# EAGLE design ProDuino-PTH (EAGLE 6.5.0)
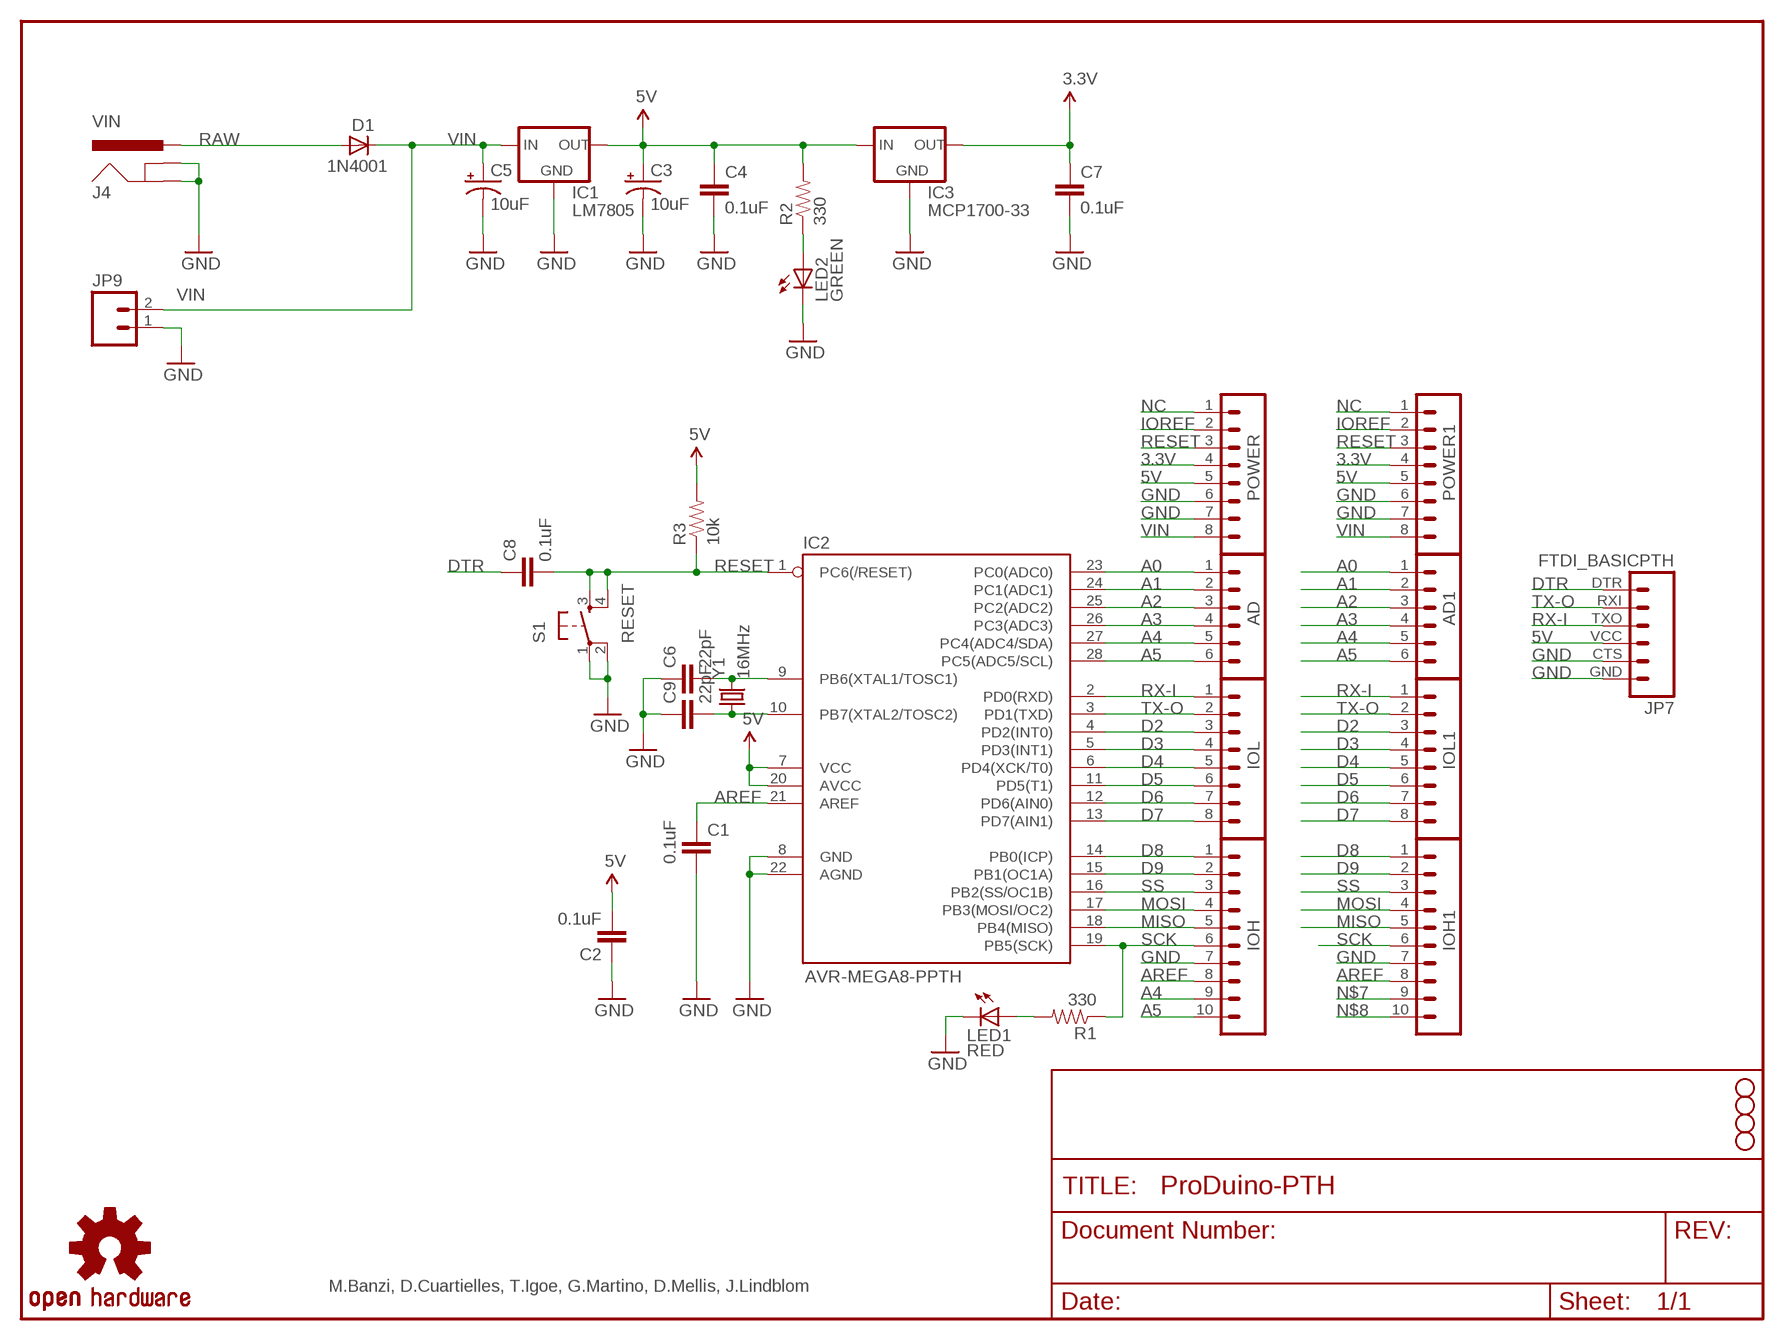
[diagram p0: schematic, sheet 1]

## Parts
AD  M06SIP  [1X06]
AD1  M06SIP  [1X06]
C1  0.1uF  CAPPTH2  [CAP-PTH-SMALL2]
C2  0.1uF  CAPPTH2  [CAP-PTH-SMALL2]
C3  10uF  CAP_POLPTH2  [CPOL-RADIAL-10UF-25V]
C4  0.1uF  CAPPTH2  [CAP-PTH-SMALL2]
C5  10uF  CAP_POLPTH2  [CPOL-RADIAL-10UF-25V]
C6  22pF  CAPPTH2  [CAP-PTH-SMALL2]
C7  0.1uF  CAPPTH2  [CAP-PTH-SMALL2]
C8  0.1uF  CAPPTH2  [CAP-PTH-SMALL2]
C9  22pF  CAPPTH2  [CAP-PTH-SMALL2]
D1  1N4001  DIODEPTH  [DIODE-1N4001]
IC1  LM7805  V_REG_78XX-TO-220  [TO-220-ALT]
IC2  AVR-MEGA8-PPTH  [DIL28-3]
IC3  MCP1700-33  V_REG_78XXTO-92  [TO-92]
IOH  M10"  [1X10]
IOH1  M10"  [1X10]
IOL  M081X08  [1X08]
IOL1  M081X08  [1X08]
J4  VIN  POWER_JACKPTH_LOCK  [POWER_JACK_PTH_LOCK]
JP3  STAND-OFF  [STAND-OFF]
JP4  STAND-OFF  [STAND-OFF]
JP5  STAND-OFF  [STAND-OFF]
JP6  STAND-OFF  [STAND-OFF]
JP7  FTDI_BASICPTH  [FTDI_BASIC]
JP9  M02POLAR  [MOLEX-1X2]
LED1  RED  LED5MM  [LED5MM]
LED2  GREEN  LED5MM  [LED5MM]
POWER  M081X08  [1X08]
POWER1  M081X08  [1X08]
R1  330  RESISTORAXIAL-0.3  [AXIAL-0.3]
R2  330  RESISTORAXIAL-0.3  [AXIAL-0.3]
R3  10k  RESISTORAXIAL-0.3  [AXIAL-0.3]
S1  RESET  TAC_SWITCHPTH  [TACTILE-PTH]
U$7  OSHW-LOGOM  [OSHW-LOGO-M]
Y1  16MHz  CRYSTALHC49US  [HC49US]

## Nets
3.3V: C7.1 IC3.3(OUT) POWER1.4 POWER.4
5V: C2.2 C3.1(+) C4.1 IC1.OUT IC2.7(VCC) IC2.20(AVCC) IC3.2(IN) JP7.VCC POWER1.5 POWER.5 R2.P$2 R3.P$2
A0: AD1.1 AD.1 IC2.23(PC0(ADC0))
A1: AD1.2 AD.2 IC2.24(PC1(ADC1))
A2: AD1.3 AD.3 IC2.25(PC2(ADC2))
A3: AD1.4 AD.4 IC2.26(PC3(ADC3))
A4: AD1.5 AD.5 IC2.27(PC4(ADC4/SDA)) IOH.9
A5: AD1.6 AD.6 IC2.28(PC5(ADC5/SCL)) IOH.10
AREF: C1.1 IC2.21(AREF) IOH1.8 IOH.8
D2: IC2.4(PD2(INT0)) IOL1.3 IOL.3
D3: IC2.5(PD3(INT1)) IOL1.4 IOL.4
D4: IC2.6(PD4(XCK/T0)) IOL1.5 IOL.5
D5: IC2.11(PD5(T1)) IOL1.6 IOL.6
D6: IC2.12(PD6(AIN0)) IOL1.7 IOL.7
D7: IC2.13(PD7(AIN1)) IOL1.8 IOL.8
D8: IC2.14(PB0(ICP)) IOH1.1 IOH.1
D9: IC2.15(PB1(OC1A)) IOH1.2 IOH.2
DTR: C8.1 JP7.DTR
GND: C1.2 C2.1 C3.2(-) C4.2 C5.2(-) C6.1 C7.2 C9.1 IC1.GND IC2.8(GND) IC2.22(AGND) IC3.1(GND) IOH1.7 IOH.7 J4.GND J4.GNDBREAK JP7.CTS JP7.GND JP9.1 LED1.K(C) LED2.K(C) POWER1.6 POWER1.7 POWER.6 POWER.7 S1.1 S1.2
IOREF: POWER1.2 POWER.2
MISO: IC2.18(PB4(MISO)) IOH1.5 IOH.5
MOSI: IC2.17(PB3(MOSI/OC2)) IOH1.4 IOH.4
N$1: LED1.A R1.P$2
N$2: LED2.A R2.P$1
N$3: C6.2 IC2.9(PB6(XTAL1/TOSC1)) Y1.2
N$4: C9.2 IC2.10(PB7(XTAL2/TOSC2)) Y1.1
N$7: IOH1.9
N$8: IOH1.10
NC: POWER1.1 POWER.1
RAW: D1.A J4.PWR
RESET: C8.2 IC2.1(PC6(/RESET)) POWER1.3 POWER.3 R3.P$1 S1.3 S1.4
RX-I: IC2.2(PD0(RXD)) IOL1.1 IOL.1 JP7.TXO
SCK: IC2.19(PB5(SCK)) IOH1.6 IOH.6 R1.P$1
SS: IC2.16(PB2(SS/OC1B)) IOH1.3 IOH.3
TX-O: IC2.3(PD1(TXD)) IOL1.2 IOL.2 JP7.RXI
VIN: C5.1(+) D1.C IC1.IN JP9.2 POWER1.8 POWER.8

## Notes on the sheet
- M.Banzi, D.Cuartielles, T.Igoe, G.Martino, D.Mellis, J.Lindblom

## Library data of the parts
AD AD1 = SparkFun:M06: Header 6 Standard 6-pin 0.1" header. Use with straight break away headers (SKU : PRT-00116), right angle break away headers (PRT-00553), swiss pins (PRT-00743), machine pins (PRT-00117), and female headers (PRT-00115). Molex polarized connector foot print use with SKU : PRT-08094 with associated crimp pins and housings. NOTES ON THE VARIANTS LOCK and LOCK_LONGPADS... This footprint was designed to help hold the alignment of a through-hole component (i.e. 6-pin header) while soldering it into place. You may notice that each hole has been shifted either up or down by 0.005 of an inch from it's more standard position (which is a perfectly straight line). This slight alteration caused the pins (the squares in the middle) to touch the edges of the holes. Because they are alternating, it causes a "brace" to hold the component in place. 0.005 has proven to be the perfect amount of "off-center" position when using our standard breakaway headers. Although looks a little odd when you look at the bare footprint, once you have a header in there, the alteration is very hard to notice. Also, if you push a header all the way into place, it is covered up entirely on the bottom side. This idea of altering the position of holes to aid alignment will be further integrated into the Sparkfun Library for other footprints. It can help hold any component with 3 or more connection pins.
C1 C2 C4 C6-C9 = SparkFun:CAP: Capacitor Standard 0603 ceramic capacitor, and 0.1" leaded capacitor.
C3 C5 = SparkFun:CAP_POL: Capacitor Polarized These are standard SMD and PTH capacitors. Normally 10uF, 47uF, and 100uF in electrolytic and tantalum varieties. Always verify the external diameter of the through hole cap, it varies with capacity, voltage, and manufacturer. The EIA devices should be standard.
D1 = SparkFun:DIODE: Diode These are standard reverse protection diodes and small signal diodes. SMA package can handle up to about 1A. SOD-323 can handle about 200mA. What the SOD-323 package when ordering, there are some mfgs out there that are 5-pin packages.
IC1 IC3 = SparkFun:V_REG_78XX: Voltage Regulator Standard 7805 5V regulator. IGO (Input Ground Output). Spark Fun Electronics SKU : COM-00107
IC2 = SparkFun:AVR-MEGA8-P: MICROCONTROLLER 8 Kbytes FLASH 1 kbytes SRAM 512 bytes EEPROM USART 4-channel 10 bit ADC 2-channel 8 bit ADC
IOH IOH1 = SparkFun-Connectors:M10: Header 10 Standard 10-pin 0.1" header. Use with straight break away headers (SKU : PRT-00116), right angle break away headers (PRT-00553), swiss pins (PRT-00743), machine pins (PRT-00117), and female headers (PRT-00115).
IOL IOL1 = SparkFun:M08: Header 8 Standard 8-pin 0.1" header. Use with straight break away headers (SKU : PRT-00116), right angle break away headers (PRT-00553), swiss pins (PRT-00743), machine pins (PRT-00117), and female headers (PRT-00115).
J4 = SparkFun:POWER_JACK: Power Jack This is the standard 5.5mm barrel jack for power. The PTH is the most common, proven, reliable, footprint. All others are experimental. The Slot footprint only works if the mill layer is transmitted to the PCB fab house so be warned. Spark Fun Electronics SKU : PRT-00119. Mating wall wart : TOL-00298 (and others)
JP3-JP6 = SparkFun:STAND-OFF: Stand Off This is the mechanical footprint for a #4 phillips button head screw. Use the keepout ring to avoid running the screw head into surrounding components. SKU : PRT-00447
JP7 = SparkFun-Connectors:FTDI_BASIC: FTDI Basic header with labels
JP9 = SparkFun:M02: Header 2 Standard 2-pin 0.1" header. Use with straight break away headers (SKU : PRT-00116), right angle break away headers (PRT-00553), swiss pins (PRT-00743), machine pins (PRT-00117), and female headers (PRT-00115). Molex polarized connector foot print use with SKU : PRT-08233 with associated crimp pins and housings.
LED1 LED2 = SparkFun:LED: LEDs Standard schematic elements and footprints for 5mm, 3mm, 1206, and 0603 sized LEDs. 5mm - Spark Fun Electronics SKU : COM-00529 (and others)
POWER POWER1 = SparkFun-Connectors:M08: Header 8 Standard 8-pin 0.1" header. Use with straight break away headers (SKU : PRT-00116), right angle break away headers (PRT-00553), swiss pins (PRT-00743), machine pins (PRT-00117), and female headers (PRT-00115).
R1-R3 = SparkFun:RESISTOR: Resistor Basic schematic elements and footprints for 0603, 1206, and PTH resistors.
S1 = SparkFun:TAC_SWITCH: Momentary Switch Button commonly used for reset or general input. Spark Fun Electronics SKU : COM-00097
U$7 = SparkFun:OSHW-LOGO: Open Source Hardware Logo This logo indicates the piece of hardware it is found on incorporates a OSHW license and/or adheres to the definition of open source hardware found here: http://freedomdefined.org/OSHW
Y1 = SparkFun:CRYSTAL: Crystals Various standard crystals. Proven footprints. Spark Fun Electronics SKU : COM-00534

## Net classes
0 default: width 0.152 mm, drill 0.305 mm, clearance 0.152 mm

## Board
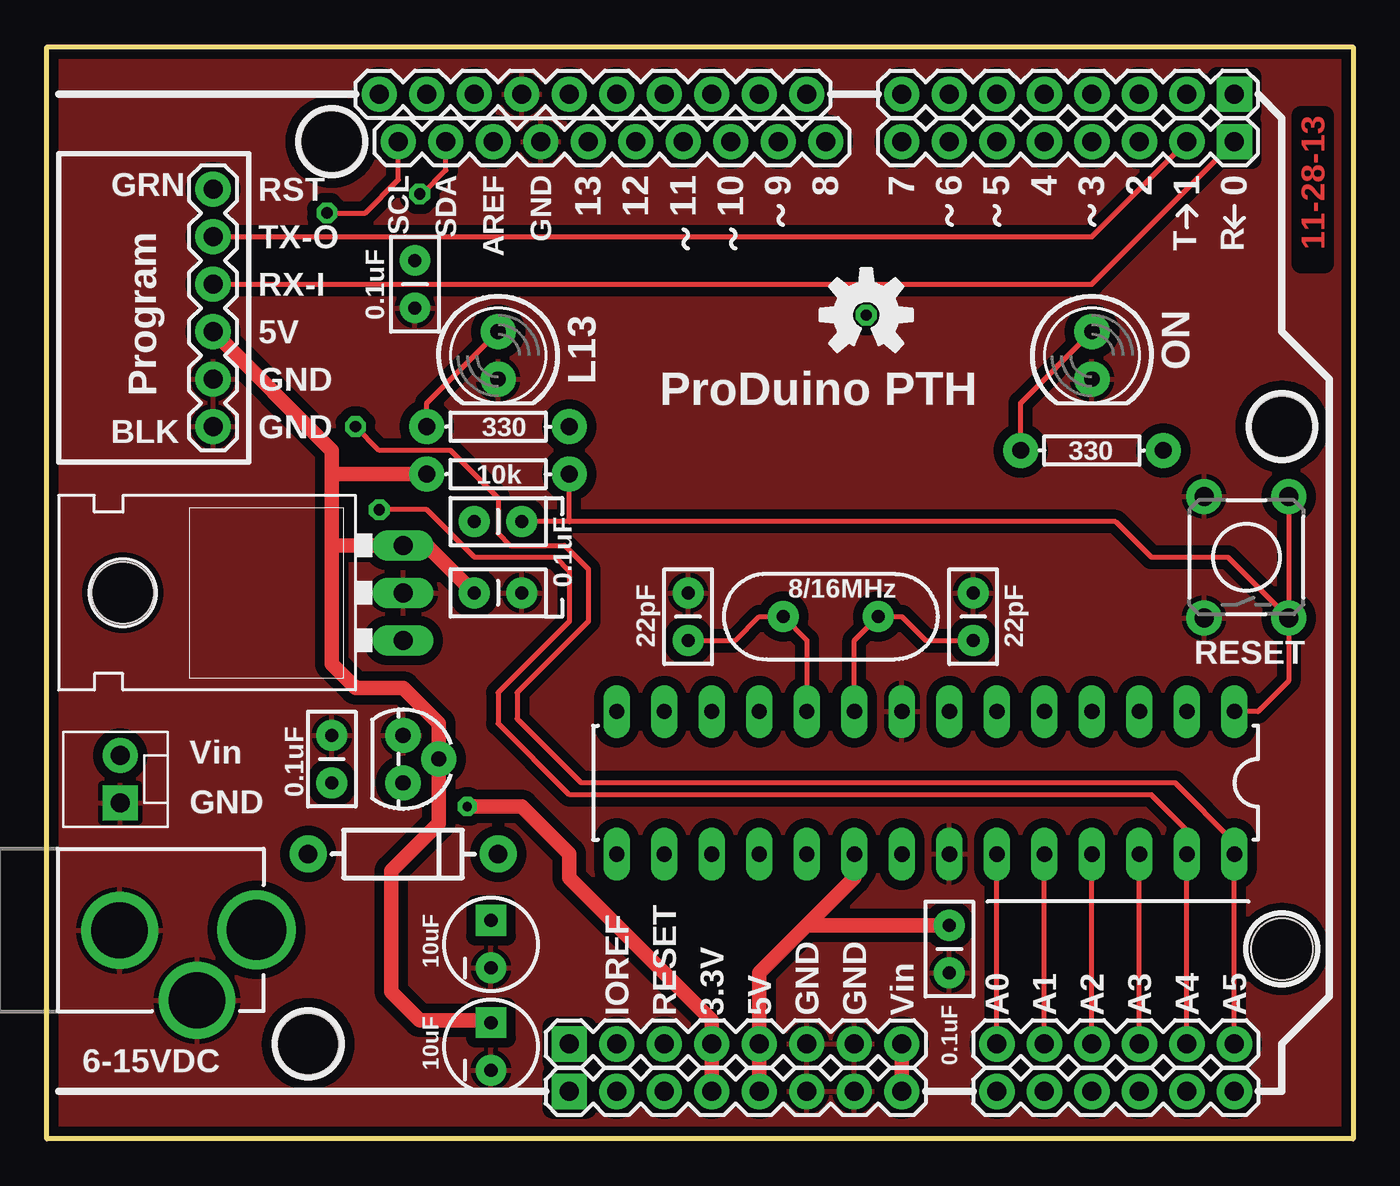
[diagram p1: board, top side]
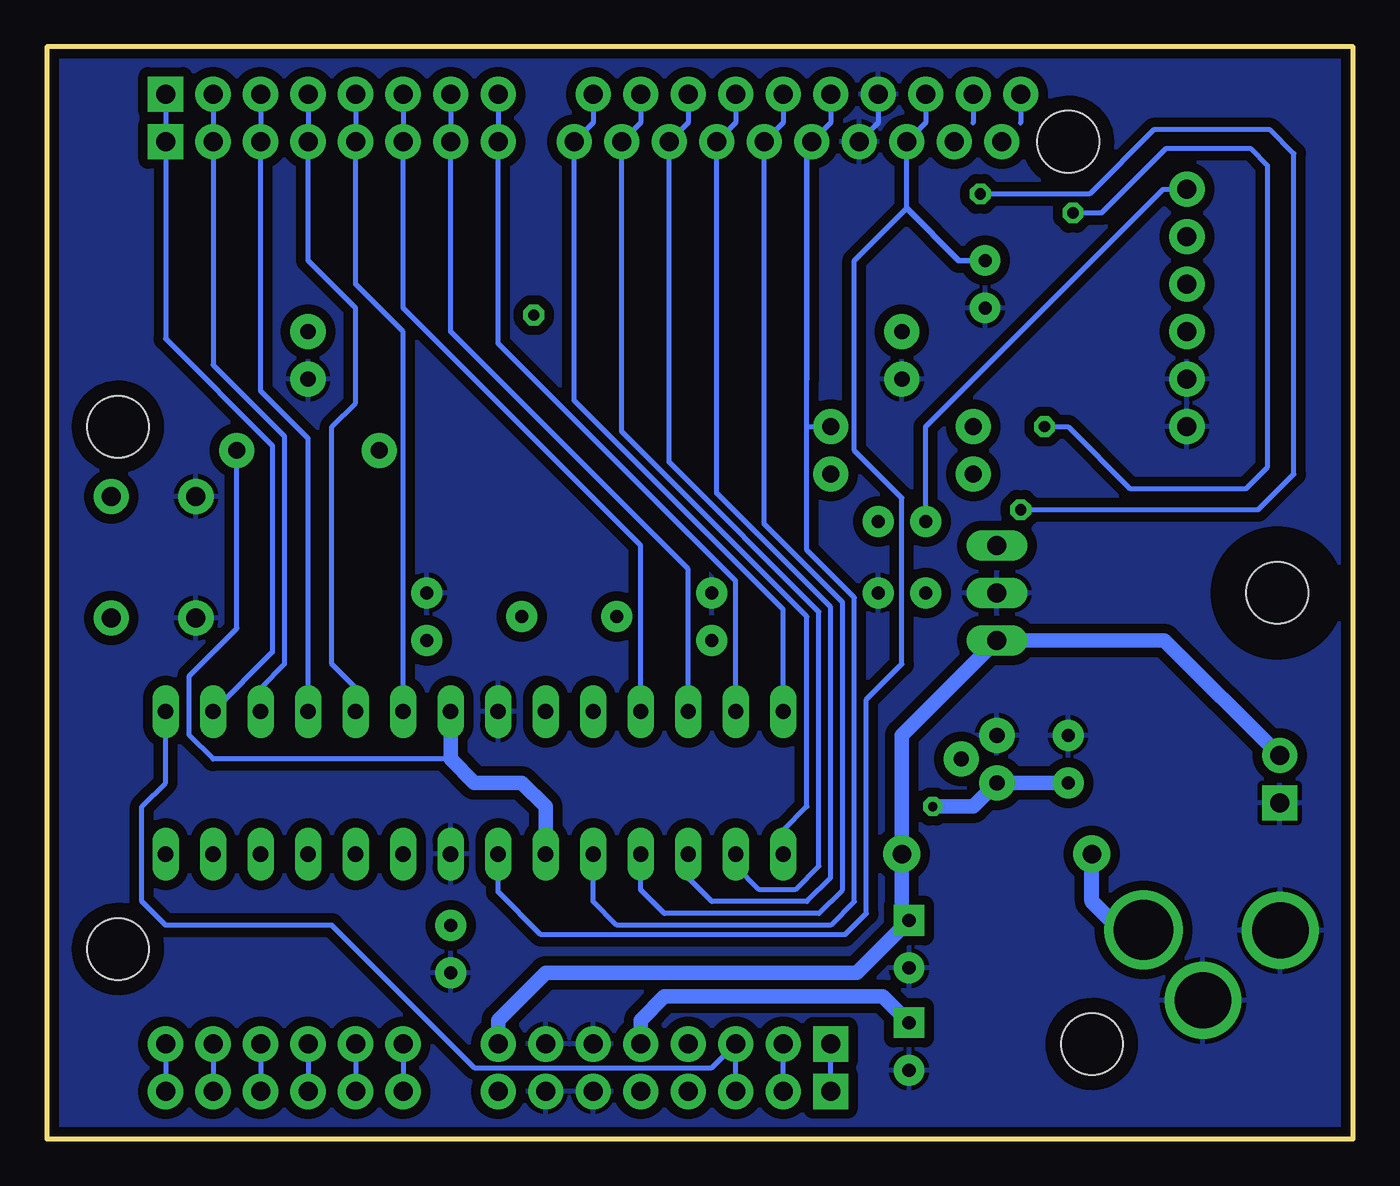
[diagram p2: board, bottom side, seen from below]

Size 69.85 x 58.42 mm. Coordinates in mm from the lower left corner, seen from the top.
Outline: 0,58.42 69.85,58.42 69.85,0 0,0 0,58.42
Copper layers (1*16): Top 0.035mm / dielectric 1.5mm / Bottom 0.035mm
Design rules "SparkFun *": minimum track width 8mil, minimum drill 20mil, track to track 8mil, track to pad 8mil, pad to pad 8mil, via to via 8mil, smd to smd 8mil, copper to edge 8mil, drill to drill 8mil, minimum pad ring 12mil, minimum via ring 10mil, stop-mask expansion 4mil, vias tented up to drill 20mil, thermal gap 10mil

### Footprints (pad centres in the part's own frame; a part is rotated, then mirrored left to right if it is on the bottom)
1X06 = drill 1.016 pad 1.88: 1 0,0; 2 2.54,0; 3 5.08,0; 4 7.62,0; 5 10.16,0; 6 12.7,0
CAP-PTH-SMALL2 = drill 0.7 pad 1.651: 1 0,0; 2 2.54,0
CPOL-RADIAL-10UF-25V = drill 0.7 pad 1.651 square: 1 1.27,0 | drill 0.7 pad 1.651: 2 -1.27,0
DIODE-1N4001 = drill 1 pad 1.981: A -5.08,0; C 5.08,0
TO-220-ALT = drill 1.016 long: GND 0,-3.81; IN -2.54,-3.81; OUT 2.54,-3.81 | hole 3.302: 0,11.176
DIL28-3 = drill 0.813 long: 1 -16.51,-3.81; 2 -13.97,-3.81; 3 -11.43,-3.81; 4 -8.89,-3.81; 5 -6.35,-3.81; 6 -3.81,-3.81; 7 -1.27,-3.81; 8 1.27,-3.81; 9 3.81,-3.81; 10 6.35,-3.81; 11 8.89,-3.81; 12 11.43,-3.81; 13 13.97,-3.81; 14 16.51,-3.81; 15 16.51,3.81; 16 13.97,3.81; 17 11.43,3.81; 18 8.89,3.81; 19 6.35,3.81; 20 3.81,3.81; 21 1.27,3.81; 22 -1.27,3.81; 23 -3.81,3.81; 24 -6.35,3.81; 25 -8.89,3.81; 26 -11.43,3.81; 27 -13.97,3.81; 28 -16.51,3.81
TO-92 = drill 0.813 pad 1.88: 1 -1.27,0; 2 0,1.905; 3 1.27,0
1X10 = drill 1.016 pad 1.88: 1 0,0; 2 2.54,0; 3 5.08,0; 4 7.62,0; 5 10.16,0; 6 12.7,0; 7 15.24,0; 8 17.78,0; 9 20.32,0; 10 22.86,0
1X08 = drill 1.016 pad 1.88 square: 1 0,0 | drill 1.016 pad 1.88: 2 2.54,0; 3 5.08,0; 4 7.62,0; 5 10.16,0; 6 12.7,0; 7 15.24,0; 8 17.78,0
POWER_JACK_PTH_LOCK = drill 2.997 pad 4.115: GND 0.025,6.557; GNDBREAK 3.762,10.7 | drill 3.2 pad 4.115: PWR 0,13.878
STAND-OFF = hole 3.302: 0,0
FTDI_BASIC = drill 1.016 pad 1.88: CTS 10.16,0; DTR 0,0; GND 12.7,0; RXI 2.54,0; TXO 5.08,0; VCC 7.62,0
MOLEX-1X2 = drill 1.016 pad 1.88 square: 1 0,0 | drill 1.016 pad 1.88: 2 2.54,0
LED5MM = drill 0.813 pad 1.88: A -1.27,0; K 1.27,0
AXIAL-0.3 = drill 0.9 pad 1.88: P$1 -3.81,0; P$2 3.81,0
TACTILE-PTH = drill 1.016 pad 1.88: 1 -3.251,2.261; 2 3.251,2.261; 3 -3.251,-2.261; 4 3.251,-2.261
HC49US = drill 0.7 pad 1.651: 1 -2.54,0; 2 2.54,0

### Placement (x,y rotation side)
AD  50.8,5.08 0 top
AD1  50.8,2.54 0 top
C1  19.68,46.99 270 top
C2  48.26,8.89 90 top
C3  23.75,4.95 90 top
C4  22.86,29.21 0 top
C5  23.75,10.41 90 top
C6  49.53,29.21 270 top
C7  15.24,19.05 90 top
C8  22.86,33.02 0 top
C9  34.29,29.21 270 top
D1  19.05,15.24 0 top
IC1  15.24,29.21 90 top
IC2  46.99,19.05 180 top
IC3  19.05,20.32 270 top
IOH  41.66,53.34 180 top
IOH1  40.64,55.88 180 top
IOL  63.5,53.34 180 top
IOL1  63.5,55.88 180 top
J4  -2.67,11.18 270 top
JP3  13.97,5.08 0 top
JP4  66.04,10.16 0 top
JP5  66.04,38.1 0 top
JP6  15.24,53.34 0 top
JP7  8.89,50.8 270 top
JP9  3.94,17.97 90 top
LED1  24.13,41.91 270 top
LED2  55.88,41.91 270 top
POWER  27.94,5.08 0 top
POWER1  27.94,2.54 0 top
R1  24.13,38.1 180 top
R2  55.88,36.83 0 top
R3  24.13,35.56 180 top
S1  64.14,31.11 90 top
U$7  43.81,44.07 0 top
Y1  41.91,27.94 0 top

### Tracks (layer width: path | path; a pad name or v marks a point on that pad's centre or on a via)
3.3V  (via drill 0.5)
  Top 0.762: v22.48,17.78 25.4,17.78 27.94,15.24 27.94,13.97 35.56,6.35 POWER.4 POWER1.4
  Bottom 0.762: C7.1 IC3.3 20.32,17.78 v22.48,17.78
5V
  Top 0.762: IC2.20 43.18,13.97 40.64,11.43 | 40.64,11.43 38.1,8.89 POWER.5 POWER1.5 | 40.64,11.43 C2.2 | JP7.VCC 15.24,36.83 15.24,35.56 | 15.24,31.75 15.24,25.4 16.51,24.13 19.05,24.13 20.95,22.23 IC3.2 20.95,16.89 18.41,14.35 18.41,7.87 19.94,6.35 23.62,6.35 C3.1 | 15.24,31.75 15.24,35.56 | C4.1 20.32,31.75 IC1.OUT 15.24,31.75 | 15.24,35.56 R3.P$2
  Bottom 0.254: 48.26,20.32 60.96,20.32 62.23,21.59 62.23,24.77 59.69,27.3 R2.P$2
  Bottom 0.762: IC2.20 43.18,17.78 44.45,19.05 46.99,19.05 48.26,20.32 IC2.7 | POWER.5 38.1,6.35 36.83,7.62 25.15,7.62 C3.1
A0
  Top 0.254: AD.1 IC2.23
  Bottom 0.254: AD.1 AD1.1
A1
  Top 0.254: AD.2 IC2.24
  Bottom 0.254: AD.2 AD1.2
A2
  Top 0.254: AD.3 IC2.25
  Bottom 0.254: AD.3 AD1.3
A3
  Top 0.254: AD.4 IC2.26
  Bottom 0.254: AD.4 AD1.4
A4  (via drill 0.6)
  Top 0.254: AD.5 IC2.27 60.96,16.51 59.05,18.41 27.94,18.41 24.13,22.23 24.13,23.88 27.94,27.69 27.94,30.35 27.18,31.11 22.86,31.11 20.32,33.66 v17.78,33.66 | v19.94,50.55 20.07,50.55 21.34,51.82 IOH.9
  Bottom 0.254: AD.5 AD1.5 | v17.78,33.66 5.08,33.66 3.17,35.56 3.17,52.7 4.45,53.98 10.67,53.98 14.1,50.55 v19.94,50.55
A5  (via drill 0.6)
  Top 0.254: AD.6 IC2.28 63.5,15.88 60.33,19.05 28.57,19.05 25.15,22.48 25.15,23.88 28.96,27.69 28.96,30.48 27.69,31.75 24.77,31.75 24.13,32.38 24.13,34.29 21.59,36.83 17.78,36.83 v16.51,38.1 | v14.99,49.53 17.02,49.53 18.8,51.31 IOH.10
  Bottom 0.254: AD.6 AD1.6 | v16.51,38.1 15.24,38.1 11.94,34.8 5.71,34.8 4.57,35.94 4.57,52.07 5.46,52.96 10.03,52.96 13.46,49.53 v14.99,49.53
AREF
  Bottom 0.254: IC2.21 45.72,13.21 43.43,10.92 27.18,10.92 26.04,12.06 26.04,23.5 24.13,25.4 24.13,34.29 26.67,36.83 26.67,46.99 23.88,49.78 IOH.8 22.86,54.36 IOH1.8
  Bottom 0.305: C1.1 21.08,46.99 23.88,49.78
D2
  Bottom 0.254: IC2.4 55.88,37.47 58.42,40.01 IOL.3 IOL1.3
D3
  Bottom 0.254: IC2.5 53.34,24.13 54.61,25.4 54.61,38.1 53.34,39.37 53.34,44.45 55.88,46.99 IOL.4 IOL1.4
D4
  Bottom 0.254: IC2.6 50.8,43.18 53.34,45.72 IOL.5 IOL1.5
D5
  Bottom 0.254: IC2.11 38.1,31.75 50.8,44.45 IOL.6 IOL1.6
D6
  Bottom 0.254: IC2.12 35.56,30.48 48.26,43.18 IOL.7 IOL1.7
D7
  Bottom 0.254: IC2.13 33.02,29.84 45.72,42.55 IOL.8 IOL1.8
D8
  Bottom 0.254: IC2.14 30.48,28.32 41.66,39.5 IOH.1 40.64,54.36 IOH1.1
D9
  Bottom 0.254: IC2.15 30.48,16.51 29.21,17.78 29.21,27.94 39.12,37.85 IOH.2 38.1,54.36 IOH1.2
DTR
  Bottom 0.254: JP7.DTR 10.16,50.8 22.86,38.1 C8.1
GND
  Bottom 0.254: IOH1.7 25.4,54.36 IOH.7
  pour Bottom (isolate 0.508): -0.64,58.42 -0.64,0 70.48,-0.64 70.48,58.42
  pour Top (isolate 0.508): 0,58.42 0,0 70.48,-0.64 70.48,58.42
IOREF
  Bottom 0.254: POWER1.2 POWER.2
MISO
  Bottom 0.254: IC2.18 38.1,13.34 36.83,12.06 28.57,12.06 27.3,13.34 27.3,28.7 31.5,32.89 IOH.5 30.48,54.36 IOH1.5
MOSI
  Bottom 0.254: IC2.17 35.56,13.97 34.29,12.7 29.21,12.7 27.94,13.97 27.94,28.45 34.04,34.54 IOH.4 33.02,54.36 IOH1.4
N$1
  Top 0.254: R1.P$2 20.32,39.37 LED1.A
N$2
  Top 0.254: R2.P$1 52.07,39.37 LED2.A
N$3
  Top 0.254: IC2.9 43.18,26.67 Y1.2 45.72,27.94 46.99,26.67 C6.2
N$4
  Top 0.254: IC2.10 40.64,26.67 Y1.1 38.1,27.94 36.83,26.67 C9.2
N$5  (via drill 0.6)
  other vias: 43.81,44.07
N$7
  Bottom 0.254: IOH1.9 20.32,54.36
N$8
  Bottom 0.254: IOH1.10 17.78,54.36
NC
  Bottom 0.254: POWER1.1 POWER.1
RAW
  Bottom 0.813: J4.PWR 12.45,11.18 13.97,12.7 D1.A
RESET
  Top 0.254: 27.94,33.02 R3.P$1 | 27.94,33.02 C8.2 | 27.94,33.02 57.15,33.02 59.05,31.11 63.14,31.11 S1.3 | S1.3 66.4,24.49 64.77,22.86 IC2.1 | S1.4 S1.3
  Bottom 0.254: IC2.1 63.5,19.05 64.77,17.78 64.77,12.7 63.5,11.43 54.61,11.43 46.99,3.81 34.29,3.81 POWER.3 POWER1.3
RX-I
  Top 0.254: JP7.TXO 55.88,45.72 IOL.1
  Bottom 0.254: IC2.2 57.78,26.04 57.78,37.08 63.5,42.8 IOL.1 IOL1.1
SCK
  Bottom 0.254: IC2.19 40.64,12.7 39.37,11.43 27.94,11.43 26.67,12.7 26.67,28.96 29.21,31.5 29.21,38.1 | 29.21,38.1 29.21,40.64 | 29.21,38.1 R1.P$1 | IOH1.6 27.94,54.36 IOH.6
  Bottom 0.305: 29.21,40.64 29.21,53.09 IOH.6
SS
  Bottom 0.254: IC2.16 33.02,14.61 31.75,13.34 29.84,13.34 28.57,14.61 28.57,28.19 36.58,36.2 IOH.3 35.56,54.36 IOH1.3
TX-O
  Top 0.254: JP7.RXI 55.88,48.26 IOL.2
  Bottom 0.254: IC2.3 58.42,24.13 57.15,25.4 57.15,37.59 60.96,41.4 IOL.2 IOL1.2
VIN
  Top 0.762: POWER.8 POWER1.8
  Bottom 0.762: POWER.8 45.72,6.35 43.18,8.89 26.54,8.89 24.13,11.3 24.13,11.56 | JP9.2 10.1,26.67 IC1.IN 24.13,21.59 D1.C 24.13,11.56 | C5.1 24,11.68 24.13,11.56

### Text on the board
Top: 11-28-13
tPlace: SCL | SDA | AREF | GND | 13 | 12 | 11 | 10 | 9 | 8 | 7 | 6 | 5 | 4 | 3 | 2 | 1 | 0 | GRN | RST | TX-O | T | R | RX-I | 0.1uF | 5V | ON | Program | GND | L13 | ProDuino PTH | BLK | GND | 0.1uF | 8/16MHz | 22pF | 22pF | RESET | Vin | 0.1uF | GND | 10uF | IOREF | RESET | 3.3V | 5V | GND | GND | Vin | A0 | A1 | A2 | A3 | A4 | A5 | 6-15VDC | 10uF | 0.1uF